# Altium project 4P_JST-PH_EXT.PrjPcb
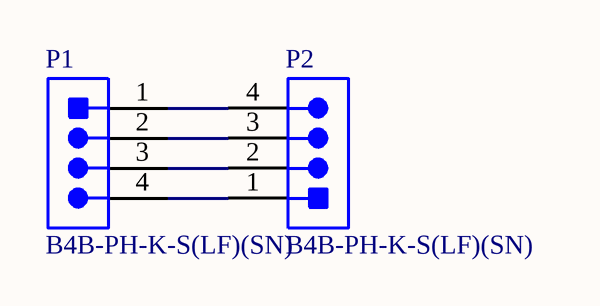
[diagram p0: 4P_JST-PH_EXT.SchDoc]
1 sheet, 2 parts. Net scope: global (net labels, ports and power ports of the same name join across sheets).
Board file: 4P_JST-PH_EXT.PcbDoc

## Sheet 4P_JST-PH_EXT.SchDoc
size A4

### Parts
P1  B4B-PH-K-S(LF)(SN)  [JST-B4B-PH-K-S_V]
P2  B4B-PH-K-S(LF)(SN)  [JST-B4B-PH-K-S_V]

### Nets
NetP1_1: P1.1 P2.4
NetP1_2: P1.2 P2.3
NetP1_3: P1.3 P2.2
NetP1_4: P1.4 P2.1

### Library data of the parts
P1 P2 = CMP-2000-05165-1: Male Header, Pitch 2 mm, 1 x 4 Position, Height 6 mm, Tail Length 3.4 mm, -25 to 85 degC, RoHS, Bulk; Manufacturer: JST; No of Positions: 4; Style/Orientation: StraightHeader/Plug; Pitch: 2mm; Datasheet URL: http://datasheet.octopart.com/B4B-PH-K-S%28LF%29%28SN%29-JST-datasheet-10558886.pdf; Type: ShroudedHeader; Manufacturer URL: http://www.jst.com/home2.html; Termination: Crimp; Datasheet Version: Apr-09